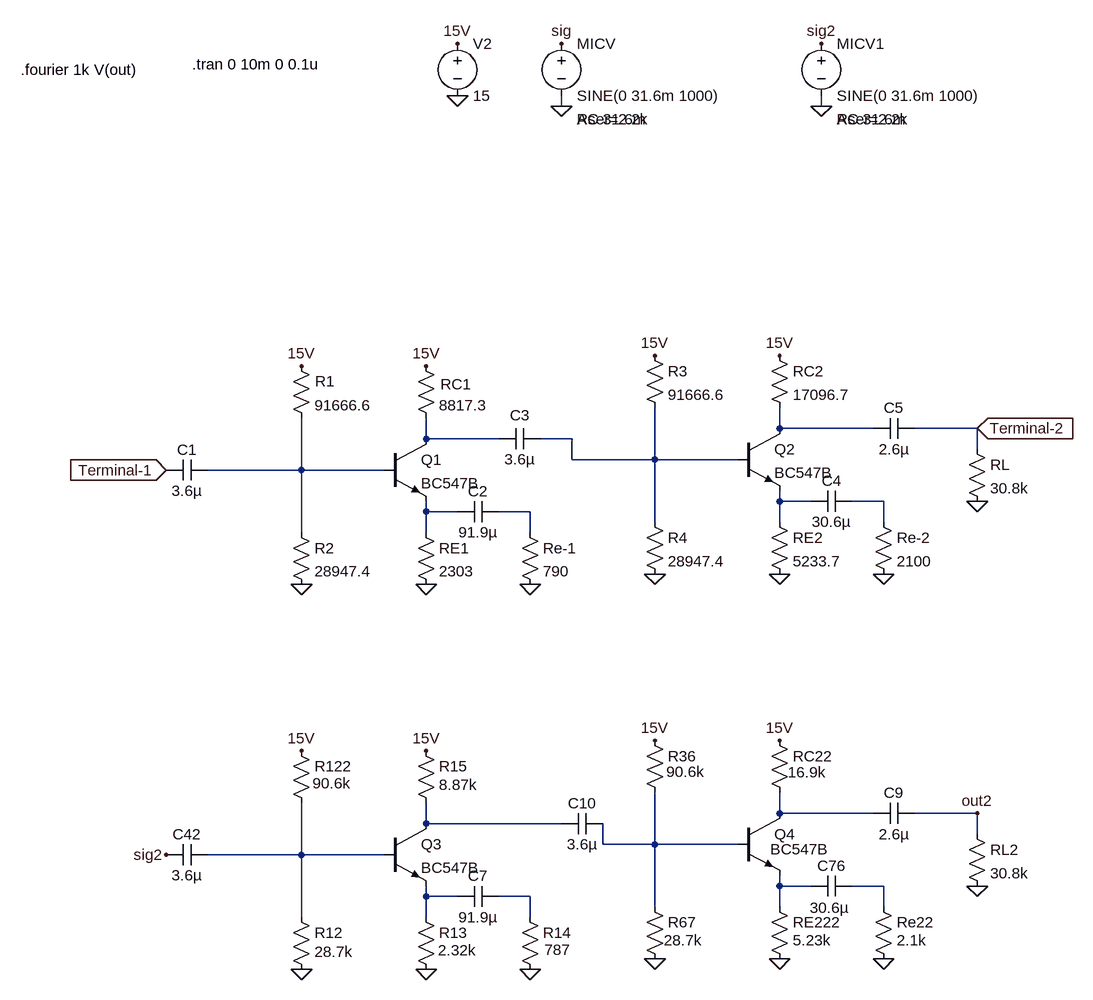
[diagram p0: schematic forforstaerker-forsogsopstilling.asc]
forforstaerker-forsogsopstilling.asc, the LTspice schematic file:
Version 4
SHEET 1 3092 976
WIRE 688 -512 688 -528
WIRE 1088 -512 1088 -528
WIRE 1024 -16 1024 -48
WIRE 1168 -16 1024 -16
WIRE 1328 -16 1232 -16
WIRE 480 0 480 -32
WIRE 592 0 480 0
WIRE 704 0 656 0
WIRE 1328 16 1328 -16
WIRE 704 32 704 0
WIRE 832 32 832 -48
WIRE 832 32 704 32
WIRE 960 32 832 32
WIRE 288 48 288 -32
WIRE 288 48 144 48
WIRE 416 48 288 48
WIRE 1024 96 1024 80
WIRE 1072 96 1024 96
WIRE 1184 96 1136 96
WIRE 480 112 480 96
WIRE 528 112 480 112
WIRE 640 112 592 112
WIRE 832 128 832 32
WIRE 1024 128 1024 96
WIRE 1184 128 1184 96
WIRE 288 144 288 48
WIRE 480 144 480 112
WIRE 640 144 640 112
WIRE 1024 576 1024 544
WIRE 1168 576 1024 576
WIRE 1328 576 1232 576
WIRE 480 592 480 560
WIRE 688 592 480 592
WIRE 1328 608 1328 576
WIRE 752 624 752 592
WIRE 832 624 832 544
WIRE 832 624 752 624
WIRE 960 624 832 624
WIRE 288 640 288 560
WIRE 288 640 144 640
WIRE 416 640 288 640
WIRE 1024 688 1024 672
WIRE 1072 688 1024 688
WIRE 1184 688 1136 688
WIRE 480 704 480 688
WIRE 528 704 480 704
WIRE 640 704 592 704
WIRE 832 720 832 624
WIRE 1024 720 1024 688
WIRE 1184 720 1184 688
WIRE 288 736 288 640
WIRE 480 736 480 704
WIRE 640 736 640 704
FLAG 640 224 0
FLAG 480 224 0
FLAG 288 224 0
FLAG 528 -608 15V
FLAG 480 -112 15V
FLAG 288 -112 15V
FLAG 528 -528 0
FLAG 1184 208 0
FLAG 1024 208 0
FLAG 832 208 0
FLAG 1024 -128 15V
FLAG 832 -128 15V
FLAG 1328 96 0
FLAG 688 -512 0
FLAG 640 816 0
FLAG 480 816 0
FLAG 288 816 0
FLAG 480 480 15V
FLAG 288 480 15V
FLAG 1184 800 0
FLAG 1024 800 0
FLAG 832 800 0
FLAG 1024 464 15V
FLAG 832 464 15V
FLAG 1328 576 out2
FLAG 1328 688 0
FLAG 688 -608 sig
FLAG 1088 -512 0
FLAG 1088 -608 sig2
FLAG 80 640 sig2
FLAG 80 48 Terminal-1
IOPIN 80 48 In
FLAG 1328 -16 Terminal-2
IOPIN 1328 -16 In
SYMBOL voltage 528 -624 R0
WINDOW 123 0 0 Left 0
WINDOW 39 0 0 Left 0
SYMATTR InstName V2
SYMATTR Value 15
SYMBOL cap 80 64 R270
WINDOW 0 32 32 VTop 0
WINDOW 3 0 32 VBottom 0
SYMATTR InstName C1
SYMATTR Value 3.6µ
SYMBOL res 272 -128 R0
WINDOW 0 37 39 Left 0
SYMATTR InstName R1
SYMATTR Value 91666.6
SYMBOL res 272 128 R0
SYMATTR InstName R2
SYMATTR Value 28947.4
SYMBOL npn 416 0 R0
SYMATTR InstName Q1
SYMATTR Value BC547B
SYMBOL res 464 128 R0
SYMATTR InstName RE1
SYMATTR Value 2303
SYMBOL res 624 128 R0
SYMATTR InstName Re-1
SYMATTR Value 790
SYMBOL res 464 -128 R0
WINDOW 0 38 44 Left 0
SYMATTR InstName RC1
SYMATTR Value 8817.3
SYMBOL cap 528 128 R270
WINDOW 0 32 32 VTop 0
WINDOW 3 0 32 VBottom 0
SYMATTR InstName C2
SYMATTR Value 91.9µ
SYMBOL voltage 688 -624 R0
WINDOW 123 24 132 Left 0
WINDOW 39 24 132 Left 0
SYMATTR Value2 AC 31.6m
SYMATTR SpiceLine Rser=2.2k
SYMATTR InstName MICV
SYMATTR Value SINE(0 31.6m 1000)
SYMBOL res 816 -144 R0
SYMATTR InstName R3
SYMATTR Value 91666.6
SYMBOL res 816 112 R0
SYMATTR InstName R4
SYMATTR Value 28947.4
SYMBOL npn 960 -16 R0
SYMATTR InstName Q2
SYMATTR Value BC547B
SYMBOL res 1008 112 R0
SYMATTR InstName RE2
SYMATTR Value 5233.7
SYMBOL res 1168 112 R0
SYMATTR InstName Re-2
SYMATTR Value 2100
SYMBOL res 1008 -144 R0
SYMATTR InstName RC2
SYMATTR Value 17096.7
SYMBOL cap 1072 112 R270
WINDOW 0 32 32 VTop 0
WINDOW 3 0 32 VBottom 0
SYMATTR InstName C4
SYMATTR Value 30.6µ
SYMBOL cap 1168 0 R270
WINDOW 0 32 32 VTop 0
WINDOW 3 0 32 VBottom 0
SYMATTR InstName C5
SYMATTR Value 2.6µ
SYMBOL cap 592 16 R270
WINDOW 0 37 32 VTop 0
WINDOW 3 0 32 VBottom 0
SYMATTR InstName C3
SYMATTR Value 3.6µ
SYMBOL res 1312 0 R0
SYMATTR InstName RL
SYMATTR Value 30.8k
SYMBOL cap 80 656 R270
WINDOW 0 32 32 VTop 0
WINDOW 3 0 32 VBottom 0
SYMATTR InstName C42
SYMATTR Value 3.6µ
SYMBOL res 272 464 R0
WINDOW 3 33 66 Left 0
SYMATTR Value 90.6k
SYMATTR InstName R122
SYMBOL res 272 720 R0
WINDOW 3 36 69 Left 0
SYMATTR Value 28.7k
SYMATTR InstName R12
SYMBOL npn 416 592 R0
SYMATTR InstName Q3
SYMATTR Value BC547B
SYMBOL res 464 720 R0
WINDOW 3 34 67 Left 0
SYMATTR Value 2.32k
SYMATTR InstName R13
SYMBOL res 624 720 R0
WINDOW 3 38 66 Left 0
SYMATTR Value 787
SYMATTR InstName R14
SYMBOL res 464 464 R0
WINDOW 3 36 68 Left 0
SYMATTR Value 8.87k
SYMATTR InstName R15
SYMBOL cap 528 720 R270
WINDOW 0 32 32 VTop 0
WINDOW 3 0 32 VBottom 0
SYMATTR InstName C7
SYMATTR Value 91.9µ
SYMBOL res 816 448 R0
WINDOW 3 34 64 Left 0
SYMATTR Value 90.6k
SYMATTR InstName R36
SYMBOL res 816 704 R0
WINDOW 3 30 67 Left 0
SYMATTR Value 28.7k
SYMATTR InstName R67
SYMBOL npn 960 576 R0
WINDOW 3 50 55 Left 0
SYMATTR Value BC547B
SYMATTR InstName Q4
SYMBOL res 1008 704 R0
WINDOW 3 36 67 Left 0
SYMATTR Value 5.23k
SYMATTR InstName RE222
SYMBOL res 1168 704 R0
WINDOW 3 36 67 Left 0
SYMATTR Value 2.1k
SYMATTR InstName Re22
SYMBOL res 1008 448 R0
WINDOW 3 29 65 Left 0
SYMATTR Value 16.9k
SYMATTR InstName RC22
SYMBOL cap 1072 704 R270
WINDOW 0 32 32 VTop 0
WINDOW 3 -2 29 VBottom 0
SYMATTR InstName C76
SYMATTR Value 30.6µ
SYMBOL cap 1168 592 R270
WINDOW 0 32 32 VTop 0
WINDOW 3 -1 32 VBottom 0
SYMATTR InstName C9
SYMATTR Value 2.6µ
SYMBOL cap 688 608 R270
WINDOW 0 32 32 VTop 0
WINDOW 3 0 32 VBottom 0
SYMATTR InstName C10
SYMATTR Value 3.6µ
SYMBOL res 1312 592 R0
SYMATTR InstName RL2
SYMATTR Value 30.8k
SYMBOL voltage 1088 -624 R0
WINDOW 123 24 132 Left 0
WINDOW 39 24 132 Left 0
SYMATTR Value2 AC 31.6m
SYMATTR SpiceLine Rser=2.2k
SYMATTR InstName MICV1
SYMATTR Value SINE(0 31.6m 1000)
TEXT 120 -576 Left 0 !.tran 0 10m 0 0.1u
TEXT -144 -568 Left 0 !.fourier 1k V(out)

The netlist it stands for:
* forforstaerker-forsogsopstilling.asc
V2 15V 0 15
C1 Terminal-1 N004 3.6µ
R1 15V N004 91666.6
R2 N004 0 28947.4
Q1 N002 N004 N007 0 BC547B
RE1 N007 0 2303
Re-1 N008 0 790
RC1 15V N002 8817.3
C2 N007 N008 91.9µ
V§MICV sig 0 SINE(0 31.6m 1000) AC 31.6m Rser=2.2k
R3 15V N003 91666.6
R4 N003 0 28947.4
Q2 N001 N003 N005 0 BC547B
RE2 N005 0 5233.7
Re-2 N006 0 2100
RC2 15V N001 17096.7
C4 N005 N006 30.6µ
C5 N001 Terminal-2 2.6µ
C3 N002 N003 3.6µ
RL Terminal-2 0 30.8k
C42 sig2 N012 3.6µ
R122 15V N012 90.6k
R12 N012 0 28.7k
Q3 N010 N012 N015 0 BC547B
R13 N015 0 2.32k
R14 N016 0 787
R15 15V N010 8.87k
C7 N015 N016 91.9µ
R36 15V N011 90.6k
R67 N011 0 28.7k
Q4 N009 N011 N013 0 BC547B
RE222 N013 0 5.23k
Re22 N014 0 2.1k
RC22 15V N009 16.9k
C76 N013 N014 30.6µ
C9 N009 out2 2.6µ
C10 N010 N011 3.6µ
RL2 out2 0 30.8k
V§MICV1 sig2 0 SINE(0 31.6m 1000) AC 31.6m Rser=2.2k
.model NPN NPN
.model PNP PNP
.lib standard.bjt
.tran 0 10m 0 0.1u
.fourier 1k V(out)
.backanno
.end